# EAGLE design US_balise (EAGLE 5.11)
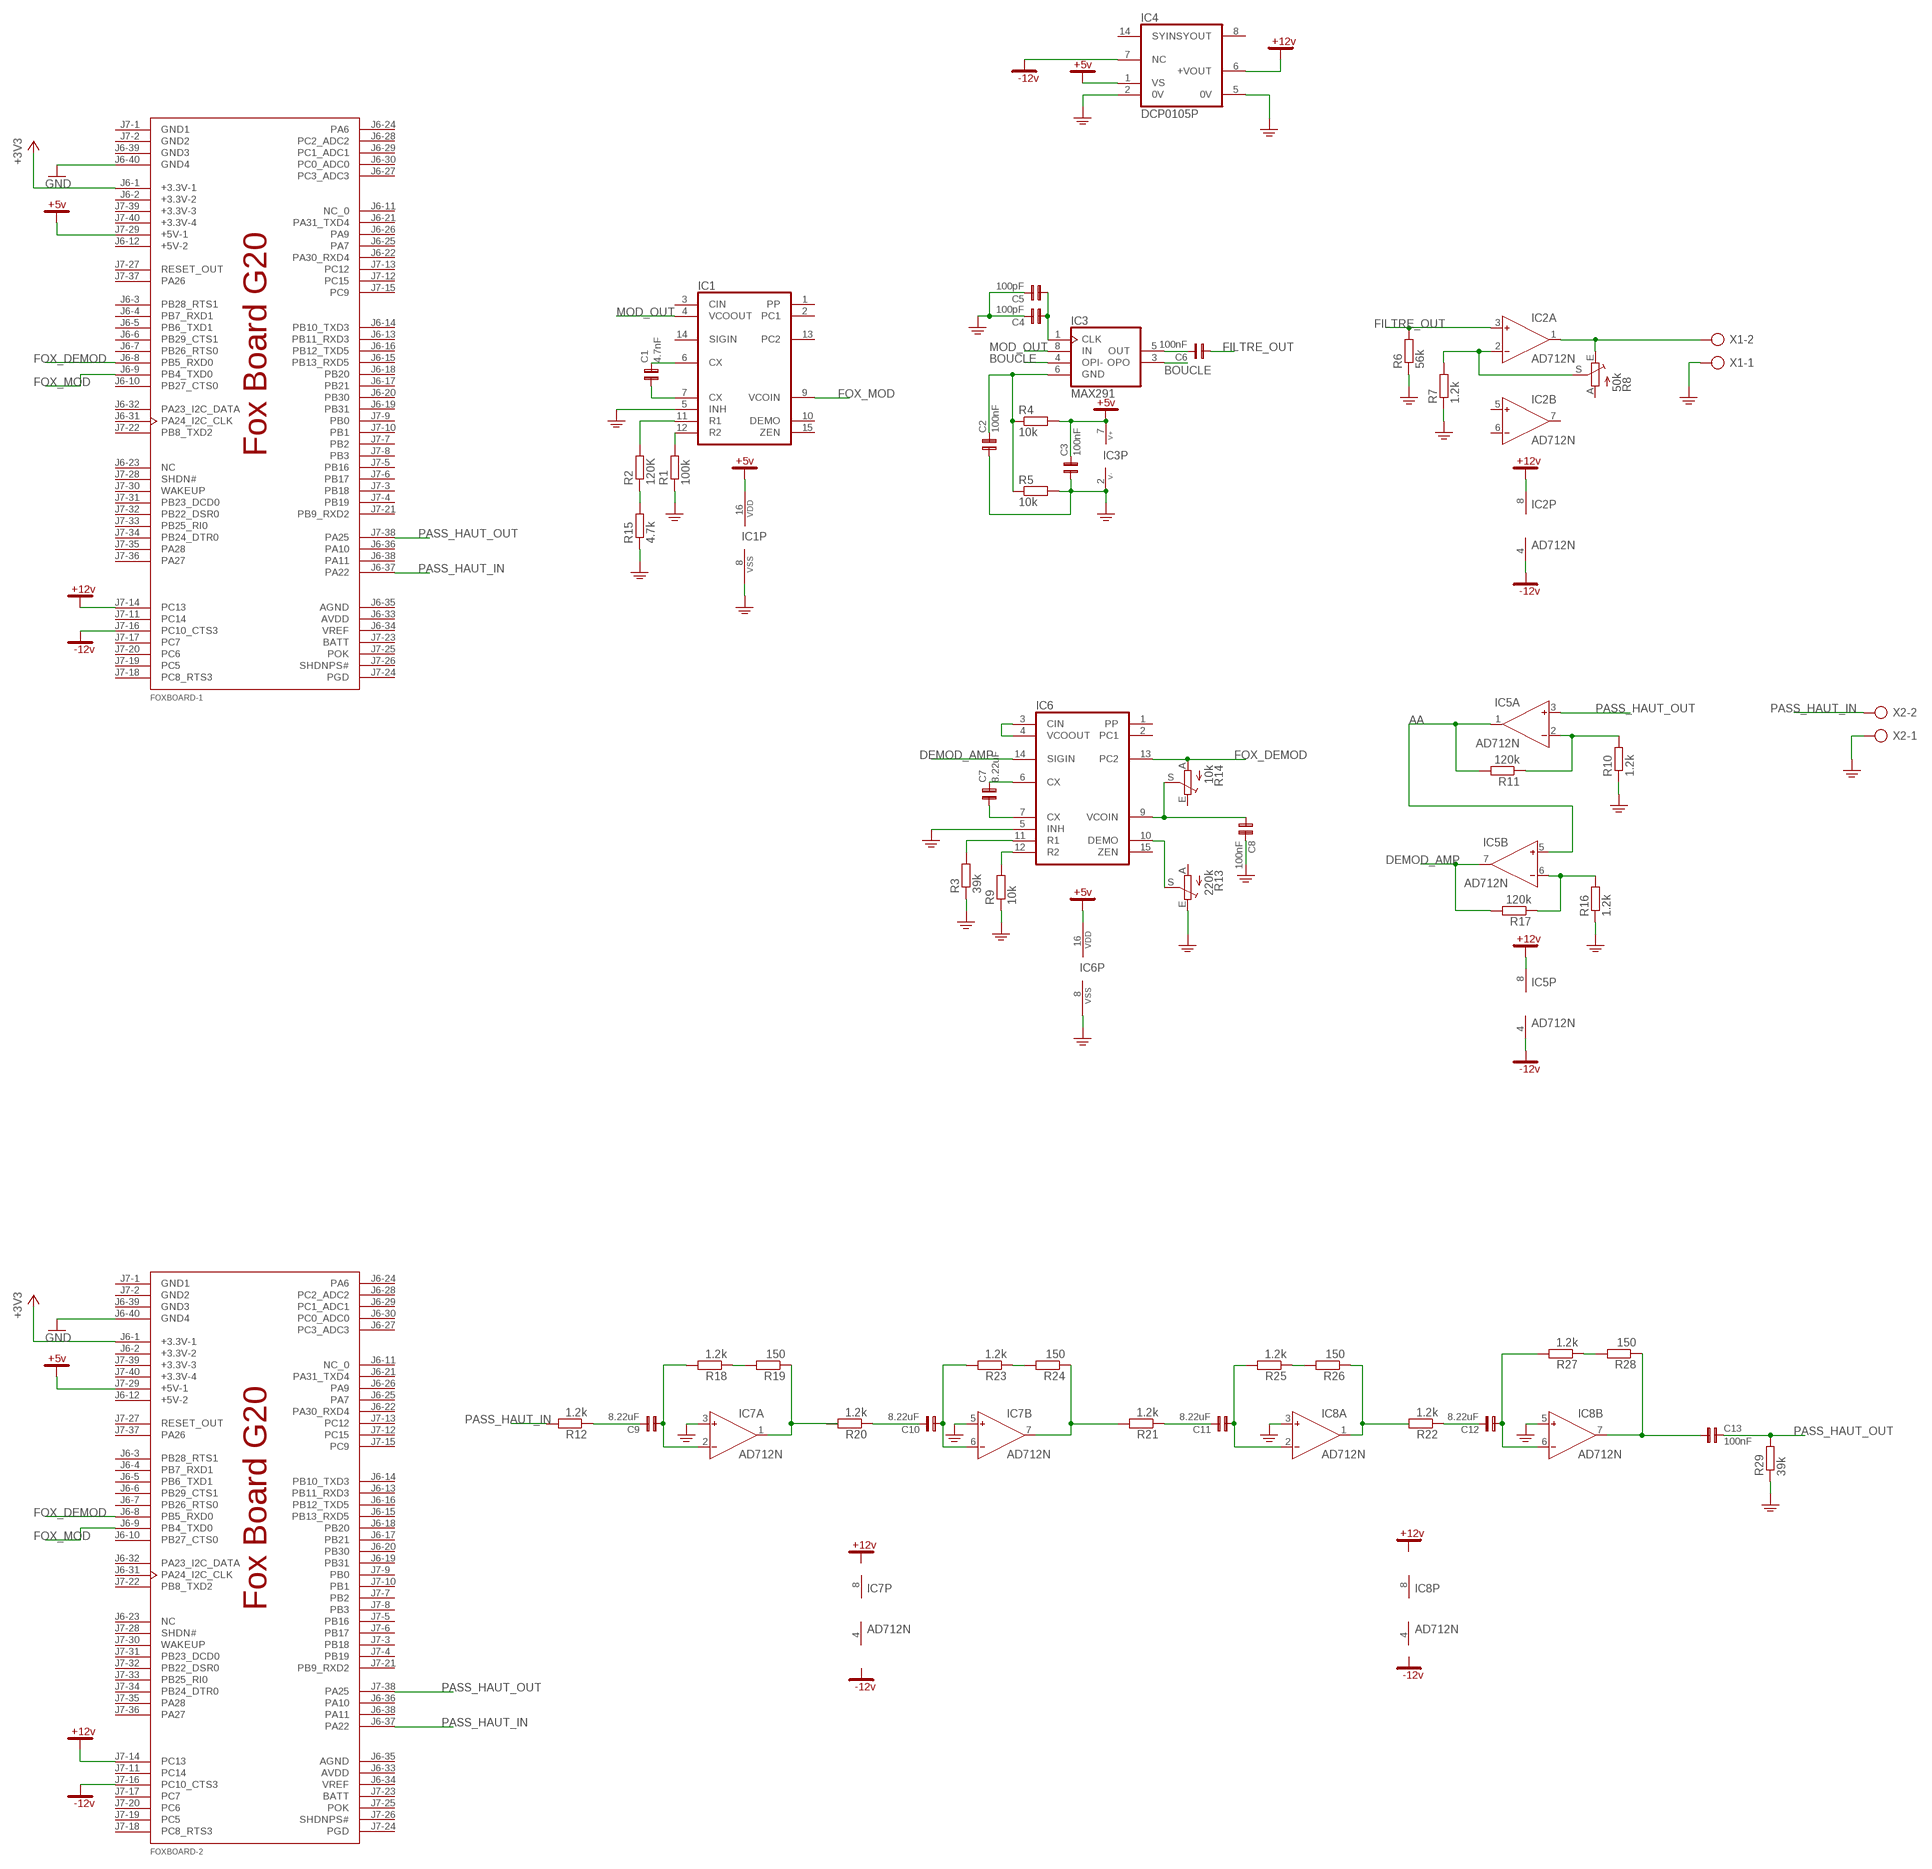
[diagram p0: schematic, sheet 1]

## Parts
C1  4.7nF  C5B2,5  [C5B2,5]
C2  100nF  C5B2,5E  [C5B2,5A]
C3  100nF  C5B2,5E  [C5B2,5A]
C4  100pF  C5B2,5  [C5B2,5]
C5  100pF  C5B2,5  [C5B2,5]
C6  100nF  C5B2,5E  [C5B2,5A]
C7  8.22uF  C5B2,5  [C5B2,5]
C8  100nF  C5B2,5E  [C5B2,5A]
C9  8.22uF  C5B2,5  [C5B2,5]
C10  8.22uF  C5B2,5  [C5B2,5]
C11  8.22uF  C5B2,5  [C5B2,5]
C12  8.22uF  C5B2,5  [C5B2,5]
C13  100nF  C5B2,5E  [C5B2,5A]
FOXBOARD-1  FOX-BOARD  [FOX-BOARD]
FOXBOARD-2  FOX-BOARD  [FOX-BOARD]
IC1  4046  [DIL16]
IC2  AD712N  [DIL08]
IC3  MAX291  [DIL08]
IC4  DCP0105P  [DIL14/7]
IC5  AD712N  [DIL08]
IC6  4046  [DIL16]
IC7  AD712N  [DIL08]
IC8  AD712N  [DIL08]
R1  100k  R-EU_0309/12  [0309/12]
R2  120K  R-EU_0309/12  [0309/12]
R3  39k  R-EU_0309/12  [0309/12]
R4  10k  R-EU_0309/12  [0309/12]
R5  10k  R-EU_0309/12  [0309/12]
R6  56k  R-EU_0309/12  [0309/12]
R7  1.2k  R-EU_0309/12  [0309/12]
R8  50k  TRIM_EU-B90P  [SP19L]
R9  10k  R-EU_0309/12  [0309/12]
R10  1.2k  R-EU_0309/12  [0309/12]
R11  120k  R-EU_0309/12  [0309/12]
R12  1.2k  R-EU_0309/12  [0309/12]
R13  220k  TRIM_EU-B90P  [SP19L]
R14  10k  TRIM_EU-S63P  [S63P]
R15  4.7k  R-EU_0309/12  [0309/12]
R16  1.2k  R-EU_0309/12  [0309/12]
R17  120k  R-EU_0309/12  [0309/12]
R18  1.2k  R-EU_0309/12  [0309/12]
R19  150  R-EU_0309/12  [0309/12]
R20  1.2k  R-EU_0309/12  [0309/12]
R21  1.2k  R-EU_0309/12  [0309/12]
R22  1.2k  R-EU_0309/12  [0309/12]
R23  1.2k  R-EU_0309/12  [0309/12]
R24  150  R-EU_0309/12  [0309/12]
R25  1.2k  R-EU_0309/12  [0309/12]
R26  150  R-EU_0309/12  [0309/12]
R27  1.2k  R-EU_0309/12  [0309/12]
R28  150  R-EU_0309/12  [0309/12]
R29  39k  R-EU_0309/12  [0309/12]
X1  AK300/2  [AK300/2]
X2  AK300/2  [AK300/2]

## Nets
+3V3: FOXBOARD-1.J6-1(+3.3V-1) FOXBOARD-2.J6-1(+3.3V-1)
+5V: C3.2 FOXBOARD-1.J7-29(+5V-1) FOXBOARD-2.J7-29(+5V-1) IC1.16(VDD) IC3.7(V+) IC4.1(VS) IC6.16(VDD) R4.2
+12V: FOXBOARD-1.J7-14(PC13) FOXBOARD-2.J7-14(PC13) IC2.8(P:V+) IC4.6(+VOUT) IC5.8(P:V+)
-12V: FOXBOARD-1.J7-16(PC10_CTS3) FOXBOARD-2.J7-16(PC10_CTS3) IC2.4(P:V-) IC4.7(NC) IC5.4(P:V-)
AA: IC5.1(A:OUT) IC5.5(B:IN+) R11.2
BOUCLE: IC3.3(OPO) IC3.4(OPI-)
DEMOD_AMP: IC5.7(B:OUT) IC6.14(SIGIN) R17.2
FILTRE_OUT: C6.1 IC2.3(A:IN+) R6.2
FOX_DEMOD: FOXBOARD-1.J6-8(PB5_RXD0) FOXBOARD-2.J6-8(PB5_RXD0) IC6.13(PC2) R14.A
FOX_MOD: FOXBOARD-1.J6-9(PB4_TXD0) FOXBOARD-2.J6-9(PB4_TXD0) IC1.9(VCOIN)
GND: C2.1 C3.1 C4.2 C5.2 C8.2 FOXBOARD-1.J6-40(GND4) FOXBOARD-2.J6-40(GND4) IC1.5(INH) IC1.8(VSS) IC3.2(V-) IC4.2(0V) IC4.5(0V) IC6.5(INH) IC6.8(VSS) IC7.3(A:IN+) IC7.5(B:IN+) IC8.3(A:IN+) IC8.5(B:IN+) R1.1 R3.1 R5.2 R6.1 R7.1 R9.1 R10.1 R13.E R15.1 R16.1 R29.1 X1.1 X2.1
MOD_OUT: IC1.4(VCOOUT) IC3.8(IN)
N$1: C1.2 IC1.6(CX)
N$2: C1.1 IC1.7(CX)
N$3: IC1.12(R2) R1.2
N$4: IC1.11(R1) R2.2
N$5: IC6.12(R2) R9.2
N$6: C6.2 IC3.5(OUT)
N$7: C2.2 IC3.6(GND) R4.1 R5.1
N$8: R2.1 R15.2
N$9: C4.1 C5.1 IC3.1(CLK)
N$10: IC2.2(A:IN-) R7.2 R8.S
N$11: IC2.1(A:OUT) R8.E X1.2
N$12: IC5.6(B:IN-) R16.2 R17.1
N$13: IC6.3(CIN) IC6.4(VCOOUT)
N$14: IC5.2(A:IN-) R10.2 R11.1
N$15: C7.2 IC6.6(CX)
N$16: C7.1 IC6.7(CX)
N$17: IC6.11(R1) R3.2
N$19: IC6.10(DEMO) R13.S
N$21: C8.1 IC6.9(VCOIN) R14.S
N$23: C9.2 R12.1
N$25: C9.1 IC7.2(A:IN-) R18.2
N$27: R18.1 R19.2
N$28: IC7.1(A:OUT) R19.1
N$29: C10.2 R20.1
N$30: C10.1 IC7.6(B:IN-) R23.2
N$31: R23.1 R24.2
N$33: IC7.7(B:OUT) R21.2 R24.1
N$34: C11.2 R21.1
N$35: C11.1 IC8.2(A:IN-) R25.2
N$36: R25.1 R26.2
N$37: IC8.1(A:OUT) R26.1
N$38: C12.2 R22.1
N$39: C12.1 IC8.6(B:IN-) R27.2
N$40: R27.1 R28.2
N$41: C13.1 IC8.7(B:OUT) R28.1
PASS_HAUT_IN: FOXBOARD-1.J6-37(PA22) FOXBOARD-2.J6-37(PA22) R12.2 X2.2
PASS_HAUT_OUT: C13.2 FOXBOARD-1.J7-38(PA25) FOXBOARD-2.J7-38(PA25) IC5.3(A:IN+) R29.2
Unconnected: FOXBOARD-1.J6-3(PB28_RTS1) FOXBOARD-1.J6-4(PB7_RXD1) FOXBOARD-1.J6-5(PB6_TXD1) FOXBOARD-1.J6-6(PB29_CTS1) FOXBOARD-1.J6-7(PB26_RTS0) FOXBOARD-1.J6-10(PB27_CTS0) FOXBOARD-1.J6-11(NC_0) FOXBOARD-1.J6-13(PB11_RXD3) FOXBOARD-1.J6-14(PB10_TXD3) FOXBOARD-1.J6-15(PB13_RXD5) FOXBOARD-1.J6-16(PB12_TXD5) FOXBOARD-1.J6-17(PB21) FOXBOARD-1.J6-18(PB20) FOXBOARD-1.J6-19(PB31) FOXBOARD-1.J6-20(PB30) FOXBOARD-1.J6-21(PA31_TXD4) FOXBOARD-1.J6-22(PA30_RXD4) FOXBOARD-1.J6-23(NC) FOXBOARD-1.J6-24(PA6) FOXBOARD-1.J6-25(PA7) FOXBOARD-1.J6-26(PA9) FOXBOARD-1.J6-27(PC3_ADC3) FOXBOARD-1.J6-28(PC2_ADC2) FOXBOARD-1.J6-29(PC1_ADC1) FOXBOARD-1.J6-30(PC0_ADC0) FOXBOARD-1.J6-31(PA24_I2C_CLK) FOXBOARD-1.J6-32(PA23_I2C_DATA) FOXBOARD-1.J6-33(AVDD) FOXBOARD-1.J6-34(VREF) FOXBOARD-1.J6-35(AGND) FOXBOARD-1.J6-36(PA10) FOXBOARD-1.J6-38(PA11) FOXBOARD-1.J7-3(PB18) FOXBOARD-1.J7-4(PB19) FOXBOARD-1.J7-5(PB16) FOXBOARD-1.J7-6(PB17) FOXBOARD-1.J7-7(PB2) FOXBOARD-1.J7-8(PB3) FOXBOARD-1.J7-9(PB0) FOXBOARD-1.J7-10(PB1) FOXBOARD-1.J7-11(PC14) FOXBOARD-1.J7-12(PC15) FOXBOARD-1.J7-13(PC12) FOXBOARD-1.J7-15(PC9) FOXBOARD-1.J7-17(PC7) FOXBOARD-1.J7-18(PC8_RTS3) FOXBOARD-1.J7-19(PC5) FOXBOARD-1.J7-20(PC6) FOXBOARD-1.J7-21(PB9_RXD2) FOXBOARD-1.J7-22(PB8_TXD2) FOXBOARD-1.J7-23(BATT) FOXBOARD-1.J7-24(PGD) FOXBOARD-1.J7-25(POK) FOXBOARD-1.J7-26(SHDNPS#) FOXBOARD-1.J7-27(RESET_OUT) FOXBOARD-1.J7-28(SHDN#) FOXBOARD-1.J7-30(WAKEUP) FOXBOARD-1.J7-31(PB23_DCD0) FOXBOARD-1.J7-32(PB22_DSR0) FOXBOARD-1.J7-33(PB25_RI0) FOXBOARD-1.J7-34(PB24_DTR0) FOXBOARD-1.J7-35(PA28) FOXBOARD-1.J7-36(PA27) FOXBOARD-1.J7-37(PA26) FOXBOARD-2.J6-3(PB28_RTS1) FOXBOARD-2.J6-4(PB7_RXD1) FOXBOARD-2.J6-5(PB6_TXD1) FOXBOARD-2.J6-6(PB29_CTS1) FOXBOARD-2.J6-7(PB26_RTS0) FOXBOARD-2.J6-10(PB27_CTS0) FOXBOARD-2.J6-11(NC_0) FOXBOARD-2.J6-13(PB11_RXD3) FOXBOARD-2.J6-14(PB10_TXD3) FOXBOARD-2.J6-15(PB13_RXD5) FOXBOARD-2.J6-16(PB12_TXD5) FOXBOARD-2.J6-17(PB21) FOXBOARD-2.J6-18(PB20) FOXBOARD-2.J6-19(PB31) FOXBOARD-2.J6-20(PB30) FOXBOARD-2.J6-21(PA31_TXD4) FOXBOARD-2.J6-22(PA30_RXD4) FOXBOARD-2.J6-23(NC) FOXBOARD-2.J6-24(PA6) FOXBOARD-2.J6-25(PA7) FOXBOARD-2.J6-26(PA9) FOXBOARD-2.J6-27(PC3_ADC3) FOXBOARD-2.J6-28(PC2_ADC2) FOXBOARD-2.J6-29(PC1_ADC1) FOXBOARD-2.J6-30(PC0_ADC0) FOXBOARD-2.J6-31(PA24_I2C_CLK) FOXBOARD-2.J6-32(PA23_I2C_DATA) FOXBOARD-2.J6-33(AVDD) FOXBOARD-2.J6-34(VREF) FOXBOARD-2.J6-35(AGND) FOXBOARD-2.J6-36(PA10) FOXBOARD-2.J6-38(PA11) FOXBOARD-2.J7-3(PB18) FOXBOARD-2.J7-4(PB19) FOXBOARD-2.J7-5(PB16) FOXBOARD-2.J7-6(PB17) FOXBOARD-2.J7-7(PB2) FOXBOARD-2.J7-8(PB3) FOXBOARD-2.J7-9(PB0) FOXBOARD-2.J7-10(PB1) FOXBOARD-2.J7-11(PC14) FOXBOARD-2.J7-12(PC15) FOXBOARD-2.J7-13(PC12) FOXBOARD-2.J7-15(PC9) FOXBOARD-2.J7-17(PC7) FOXBOARD-2.J7-18(PC8_RTS3) FOXBOARD-2.J7-19(PC5) FOXBOARD-2.J7-20(PC6) FOXBOARD-2.J7-21(PB9_RXD2) FOXBOARD-2.J7-22(PB8_TXD2) FOXBOARD-2.J7-23(BATT) FOXBOARD-2.J7-24(PGD) FOXBOARD-2.J7-25(POK) FOXBOARD-2.J7-26(SHDNPS#) FOXBOARD-2.J7-27(RESET_OUT) FOXBOARD-2.J7-28(SHDN#) FOXBOARD-2.J7-30(WAKEUP) FOXBOARD-2.J7-31(PB23_DCD0) FOXBOARD-2.J7-32(PB22_DSR0) FOXBOARD-2.J7-33(PB25_RI0) FOXBOARD-2.J7-34(PB24_DTR0) FOXBOARD-2.J7-35(PA28) FOXBOARD-2.J7-36(PA27) FOXBOARD-2.J7-37(PA26) IC1.1(PP) IC1.2(PC1) IC1.3(CIN) IC1.10(DEMO) IC1.13(PC2) IC1.14(SIGIN) IC1.15(ZEN) IC2.5(B:IN+) IC2.6(B:IN-) IC2.7(B:OUT) IC4.8(SYOUT) IC4.14(SYIN) IC6.1(PP) IC6.2(PC1) IC6.15(ZEN) R8.A R13.A R14.E R20.2 R22.2

## Power pins joined to a net without a drawn wire
+3.3V-2: FOXBOARD-1.J6-2(+3.3V-2) FOXBOARD-2.J6-2(+3.3V-2)
+3.3V-3: FOXBOARD-1.J7-39(+3.3V-3) FOXBOARD-2.J7-39(+3.3V-3)
+3.3V-4: FOXBOARD-1.J7-40(+3.3V-4) FOXBOARD-2.J7-40(+3.3V-4)
+5V-2: FOXBOARD-1.J6-12(+5V-2) FOXBOARD-2.J6-12(+5V-2)
GND1: FOXBOARD-1.J7-1(GND1) FOXBOARD-2.J7-1(GND1)
GND2: FOXBOARD-1.J7-2(GND2) FOXBOARD-2.J7-2(GND2)
GND3: FOXBOARD-1.J6-39(GND3) FOXBOARD-2.J6-39(GND3)
V+: IC7.8(P:V+) IC8.8(P:V+)
V-: IC7.4(P:V-) IC8.4(P:V-)

## Library data of the parts
C1 C4 C5 C7 C9-C12 = CAP:C5B2,5
C2 C3 C6 C8 C13 = CAP:C5B2,5E
FOXBOARD-1 FOXBOARD-2 = Julien:FOX-BOARD
IC1 IC6 = 40XX:4046
IC2 IC5 IC7 IC8 = analog-devices:AD712: Dual Precision, Low Cost, High Speed BiFET Op Amp Source: http://www.analog.com/static/imported-files/data_sheets/AD712.pdf; MF: ALTERA CORPORATION; MPN: AD712JNZ; OC_FARNELL: 9604898; OC_NEWARK: 59K4554
IC3 = maxim:MAX291: DIGITAL FILTER; MPN: MAX291CPA+; OC_FARNELL: unknown; OC_NEWARK: 67K4526
IC4 = burr-brown:DCP0105: DC/DC Converters Miniature 5V Input, 1W Isolated Unregulated; MPN: DCP010512BP-U; OC_FARNELL: 1461015; OC_NEWARK: 61M5777
R1-R7 R9-R12 R15-R29 = rcl:R-EU_: RESISTOR, European symbol
R8 R13 R14 = pot:TRIM_EU-: POTENTIOMETER
X1 X2 = con-ptr500:AK300/2: CONNECTOR; OC_FARNELL: unknown; OC_NEWARK: unknown

## Board
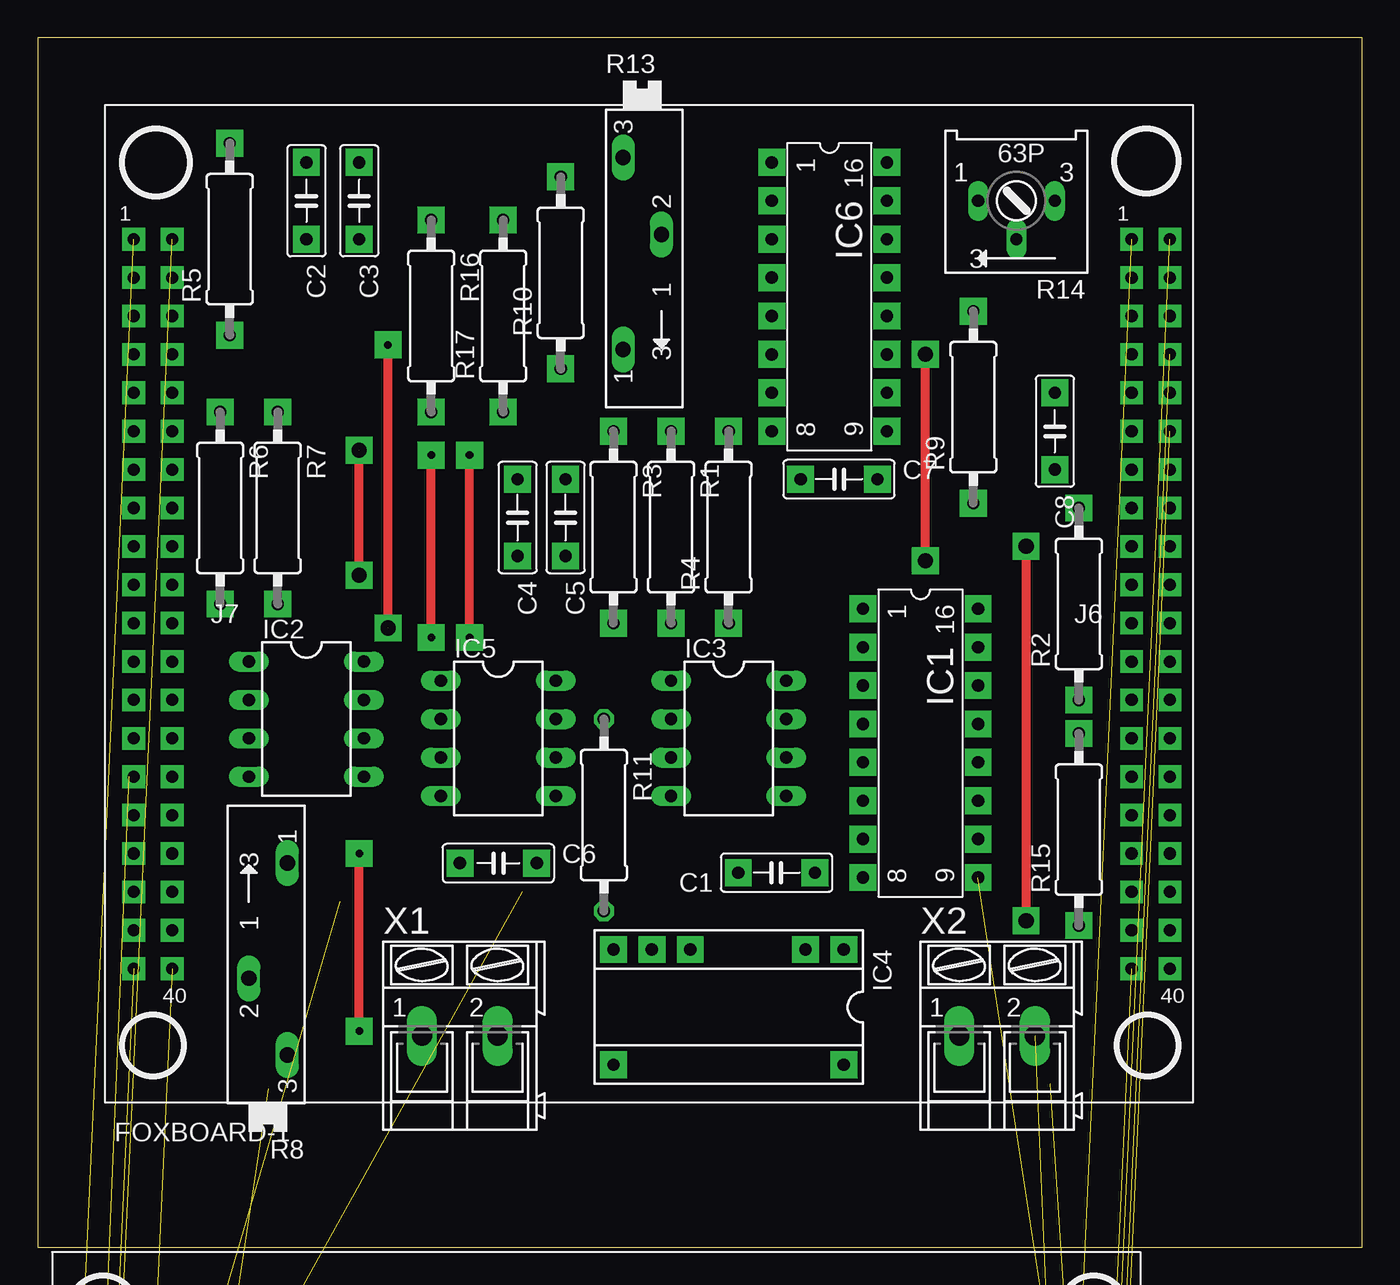
[diagram p1: board, top side]
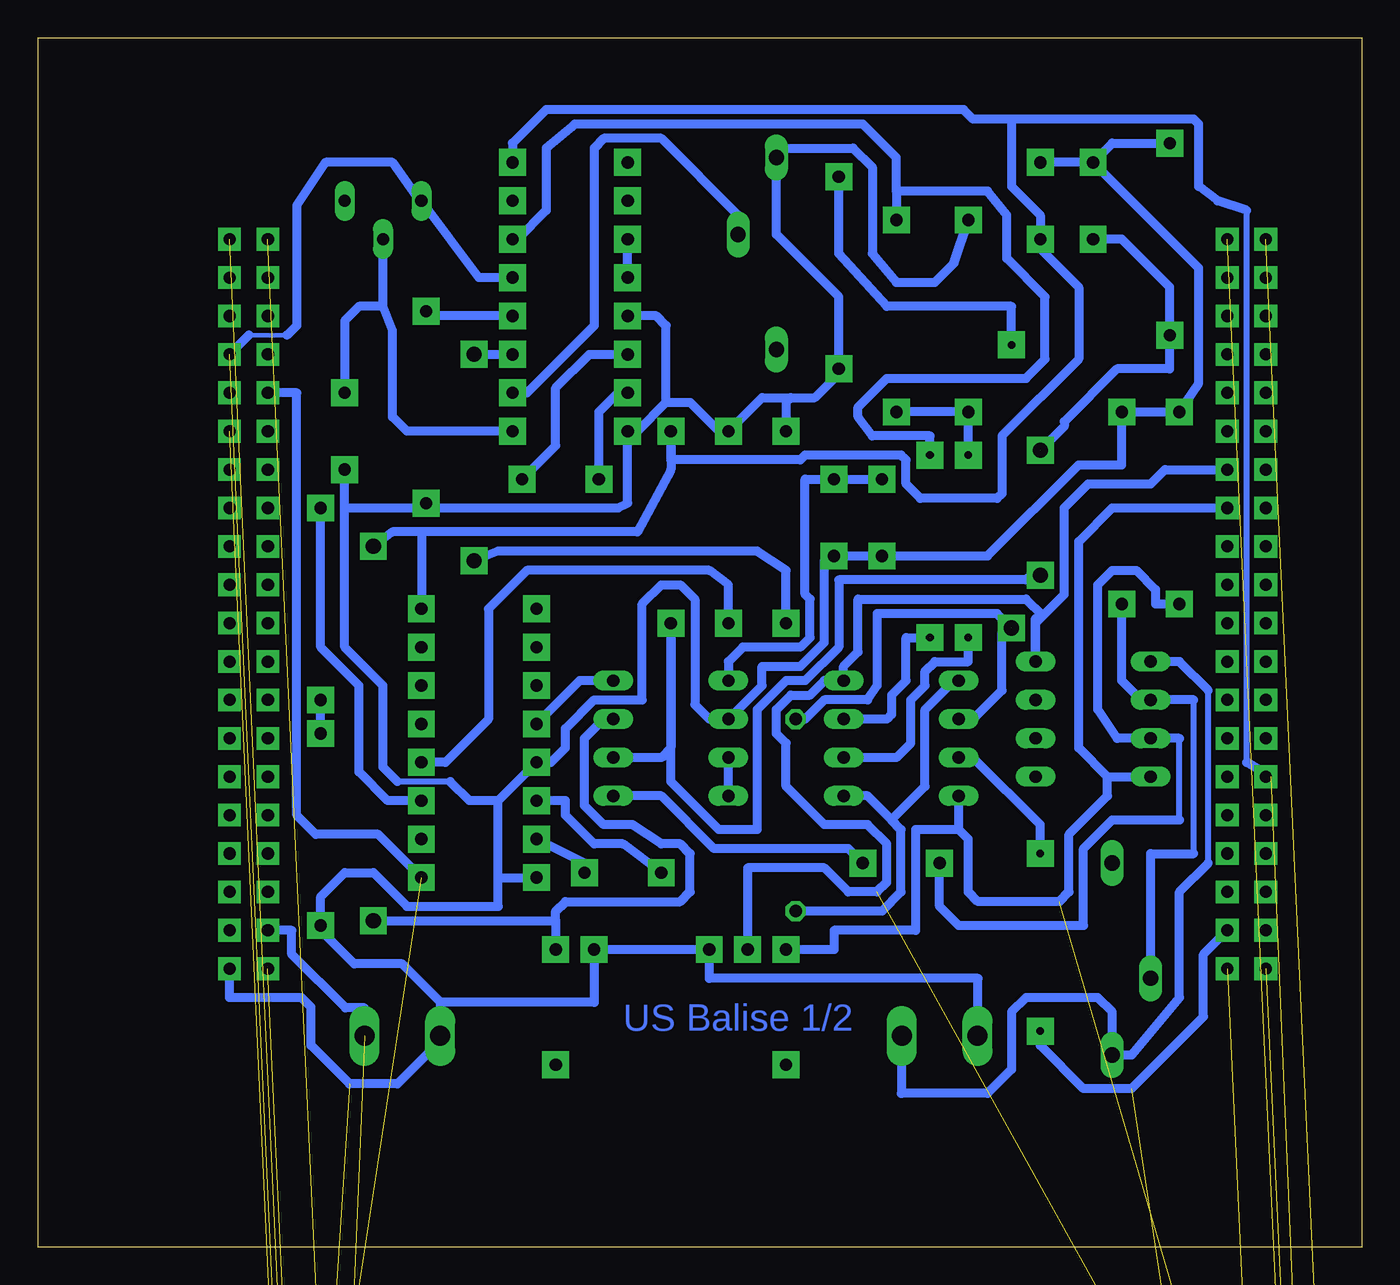
[diagram p2: board, bottom side, seen from below]

Size 87.62 x 80 mm. Coordinates in mm from the lower left corner, seen from the top.
Outline: 0,0 87.62,0 87.62,80 0,80 0,0
Copper layers (1*16): Top 0.035mm / dielectric 1.5mm / Bottom 0.035mm
Design rules "default": minimum track width 10mil, minimum drill 24mil, track to track 8mil, track to pad 8mil, pad to pad 8mil, via to via 8mil, smd to smd 8mil, copper to edge 40mil, drill to drill 8mil, minimum pad ring 10mil, minimum via ring 8mil, stop-mask expansion 4mil, vias tented up to drill 0mil, thermal gap 10mil

### Footprints (pad centres in the part's own frame; a part is rotated, then mirrored left to right if it is on the bottom)
C5B2,5 = drill 0.813 pad 1.778 square: 1 -2.54,0; 2 2.54,0
C5B2,5A = drill 0.813 pad 1.778 square: 1 -2.54,0; 2 2.54,0
FOX-BOARD = drill 0.8 pad 1.5 square: J6-1 31.75,22.86; J6-2 34.29,22.86; J6-3 31.75,20.32; J6-4 34.29,20.32; J6-5 31.75,17.78; J6-6 34.29,17.78; J6-7 31.75,15.24; J6-8 34.29,15.24; J6-9 31.75,12.7; J6-10 34.29,12.7; J6-11 31.75,10.16; J6-12 34.29,10.16; J6-13 31.75,7.62; J6-14 34.29,7.62; J6-15 31.75,5.08; J6-16 34.29,5.08; J6-17 31.75,2.54; J6-18 34.29,2.54; J6-19 31.75,0; J6-20 34.29,0; J6-21 31.75,-2.54; J6-22 34.29,-2.54; J6-23 31.75,-5.08; J6-24 34.29,-5.08; J6-25 31.75,-7.62; J6-26 34.29,-7.62; J6-27 31.75,-10.16; J6-28 34.29,-10.16; J6-29 31.75,-12.7; J6-30 34.29,-12.7; J6-31 31.75,-15.24; J6-32 34.29,-15.24; J6-33 31.75,-17.78; J6-34 34.29,-17.78; J6-35 31.75,-20.32; J6-36 34.29,-20.32; J6-37 31.75,-22.86; J6-38 34.29,-22.86; J6-39 31.75,-25.4; J6-40 34.29,-25.4; J7-1 -34.29,22.86; J7-2 -31.75,22.86; J7-3 -34.29,20.32; J7-4 -31.75,20.32; J7-5 -34.29,17.78; J7-6 -31.75,17.78; J7-7 -34.29,15.24; J7-8 -31.75,15.24; J7-9 -34.29,12.7; J7-10 -31.75,12.7; J7-11 -34.29,10.16; J7-12 -31.75,10.16; J7-13 -34.29,7.62; J7-14 -31.75,7.62; J7-15 -34.29,5.08; J7-16 -31.75,5.08; J7-17 -34.29,2.54; J7-18 -31.75,2.54; J7-19 -34.29,0; J7-20 -31.75,0; J7-21 -34.29,-2.54; J7-22 -31.75,-2.54; J7-23 -34.29,-5.08; J7-24 -31.75,-5.08; J7-25 -34.29,-7.62; J7-26 -31.75,-7.62; J7-27 -34.29,-10.16; J7-28 -31.75,-10.16; J7-29 -34.29,-12.7; J7-30 -31.75,-12.7; J7-31 -34.29,-15.24; J7-32 -31.75,-15.24; J7-33 -34.29,-17.78; J7-34 -31.75,-17.78; J7-35 -34.29,-20.32; J7-36 -31.75,-20.32; J7-37 -34.29,-22.86; J7-38 -31.75,-22.86; J7-39 -34.29,-25.4; J7-40 -31.75,-25.4
DIL16 = drill 0.813 pad 1.778 square: 1 -8.89,-3.81; 2 -6.35,-3.81; 3 -3.81,-3.81; 4 -1.27,-3.81; 5 1.27,-3.81; 6 3.81,-3.81; 7 6.35,-3.81; 8 8.89,-3.81; 9 8.89,3.81; 10 6.35,3.81; 11 3.81,3.81; 12 1.27,3.81; 13 -1.27,3.81; 14 -3.81,3.81; 15 -6.35,3.81; 16 -8.89,3.81
DIL08 = drill 0.813 long: 1 -3.81,-3.81; 2 -1.27,-3.81; 3 1.27,-3.81; 4 3.81,-3.81; 5 3.81,3.81; 6 1.27,3.81; 7 -1.27,3.81; 8 -3.81,3.81
DIL14/7 = drill 0.813 pad 1.6 octagon: 1 -7.62,-3.81; 2 -5.08,-3.81; 5 2.54,-3.81; 6 5.08,-3.81; 7 7.62,-3.81; 8 7.62,3.81; 14 -7.62,3.81
0309/12 = drill 0.813 octagon: 1 -6.35,0; 2 6.35,0
SP19L = drill 1.016 long: A 5.715,-1.27; E -6.985,-1.27; S -1.905,1.27
S63P = drill 0.813 long: A 2.54,0; E -2.54,0; S 0,2.54
AK300/2 = drill 1.321 long: 1 -2.515,0; 2 2.489,0

### Placement (x,y rotation side)
C1  48.9,24.77 180 top
C2  17.78,69.22 270 top
C3  21.27,69.22 270 top
C4  31.75,48.26 270 top
C5  34.92,48.26 270 top
C6  30.48,25.4 0 top
C7  53.02,50.8 0 top
C8  67.31,53.98 270 top
C9  1.59,-119.38 0 top  (outside the outline)
C10  -0.32,-146.69 0 top  (outside the outline)
C11  -0.32,-157.16 0 top  (outside the outline)
C12  -0.32,-167.64 0 top  (outside the outline)
C13  -0.64,-207.65 0 top  (outside the outline)
FOXBOARD-1  40.64,43.81 0 top
FOXBOARD-2  37.15,-32.07 0 top  (outside the outline)
IC1  58.42,33.34 270 top
IC2  17.78,34.92 270 top
IC3  45.72,33.66 270 top
IC4  45.72,15.88 180 top
IC5  30.48,33.66 270 top
IC6  52.39,62.87 270 top
IC7  5.4,-98.11 0 top  (outside the outline)
IC8  5.08,-110.81 0 top  (outside the outline)
R1  41.91,47.62 270 top
R2  68.9,42.55 90 top
R3  38.1,47.62 270 top
R4  45.72,47.62 90 top
R5  12.7,66.67 90 top
R6  12.06,48.9 270 top
R7  15.88,48.9 270 top
R8  15.24,19.68 90 top
R9  61.91,55.56 90 top
R10  34.61,64.45 90 top
R11  37.47,28.57 270 top
R12  5.08,-125.73 0 top  (outside the outline)
R13  40.01,65.09 270 top
R14  64.77,69.22 180 top
R15  68.9,27.62 90 top
R16  26.04,61.59 270 top
R17  30.8,61.59 90 top
R18  4.45,-131.13 0 top  (outside the outline)
R19  3.81,-136.53 0 top  (outside the outline)
R20  3.81,-142.56 0 top  (outside the outline)
R21  3.81,-153.03 0 top  (outside the outline)
R22  3.81,-163.51 0 top  (outside the outline)
R23  3.81,-173.99 0 top  (outside the outline)
R24  3.81,-180.02 0 top  (outside the outline)
R25  3.81,-186.06 0 top  (outside the outline)
R26  3.81,-192.09 0 top  (outside the outline)
R27  3.81,-198.12 0 top  (outside the outline)
R28  3.81,-204.15 0 top  (outside the outline)
R29  2.86,-214 0 top  (outside the outline)
X1  27.94,13.97 0 top
X2  63.5,13.97 0 top

### Tracks (layer width: path | path; a pad name or v marks a point on that pad's centre or on a via)
+3.3V-2  (1 unrouted)
+3.3V-3  (1 unrouted)
+3.3V-4  (1 unrouted)
+3V3  (1 unrouted)
+5V  (via drill 1 pad 0.13)  (1 unrouted)
  Top 0.61: v65.41,46.35 v65.41,21.59
  Bottom 0.406: 7.62,32.07 7.62,68.58
  Bottom 0.61: 53.34,21.59 53.34,22.23 52.7,22.86 45.09,22.86 44.45,23.5 44.45,26.04 45.09,26.67 46.35,26.67 48.26,27.94 50.16,27.94 51.44,29.21 51.44,33.66 50.16,34.92 IC3.7 | 53.34,21.59 IC4.1 | 62.23,47.31 IC1.16 | 62.23,47.31 47.94,47.31 45.72,51.44 R4.2 45.72,52.07 37.15,52.07 36.83,52.39 30.48,52.39 30.16,52.07 30.16,50.48 29.21,49.53 24.13,49.53 23.81,49.85 23.81,53.66 18.73,58.74 18.73,63.5 21.27,66.04 C3.2 21.27,68.26 23.18,70.17 23.18,74.61 | FOXBOARD-1.J7-29 6.03,31.11 7.62,32.07 | 7.62,68.58 9.53,69.22 10.79,70.17 10.79,74.3 11.11,74.61 23.18,74.61 | 62.23,47.31 64.14,47.31 v65.41,46.35 | v65.41,21.59 53.34,21.59 | IC6.16 56.2,73.03 53.98,75.25 26.35,75.25 25.72,74.61 23.18,74.61
+5V-2  (1 unrouted)
+12V  (1 unrouted)
  Bottom 0.61: IC4.6 40.64,25.08 35.56,25.08 33.97,23.5 32.07,23.5 31.43,24.13 31.43,26.67 32.7,27.94 35.56,27.94 38.1,30.48 38.1,33.34 38.73,33.97 38.73,35.56 37.78,36.51 36.51,36.51 35.56,37.47 IC5.8 34.29,38.42 33.34,39.37 33.34,42.86 22.23,42.86 21.11,41.75 | 21.11,41.75 19.68,43.18 19.68,48.9 18.1,50.48 13.97,50.48 13.02,51.44 FOXBOARD-1.J7-14 | 21.11,41.75 21.59,41.27 IC2.8 21.59,41.59
-12V  (1 unrouted)
  Bottom 0.61: 16.83,31.11 IC2.4 | 26.67,27.62 IC5.4 | IC4.7 34.92,19.68 34.92,20.95 29.53,20.95 29.53,27.62 26.67,27.62 | 16.83,31.11 16.83,29.84 19.37,27.3 19.37,23.5 20,22.86 25.4,22.86 26.04,23.5 26.04,26.99 26.67,27.62 | FOXBOARD-1.J7-16 16.51,48.9 18.73,46.67 18.73,33.02 16.83,31.11
AA
  Bottom 0.61: IC5.5 32.7,29.84 31.11,28.26 | R11.2 31.75,22.23 30.48,23.5 30.48,27.62 31.11,28.26 | IC5.1 26.99,37.47 28.89,35.56 28.89,30.48 31.11,28.26
BOUCLE
  Bottom 0.61: IC3.4 IC3.3
DEMOD_AMP  (via drill 0.5 pad 1.78)  (1 unrouted)
  Top 0.61: 28.57,40.32 v28.57,52.39
  Bottom 0.61: IC6.14 55.88,66.67 53.98,68.58 53.98,72.71 52.07,74.3 33.02,74.3 30.8,72.07 30.8,69.85 | 30.8,69.85 R17.2 | 30.8,69.85 24.77,69.85 23.5,68.26 23.5,65.41 20.95,62.87 20.95,58.74 22.23,57.47 31.43,57.47 33.34,55.56 33.34,54.93 32.38,53.66 28.57,53.66 v28.57,52.39 | IC5.7 31.43,34.92 31.11,35.24 31.11,36.51 30.16,37.47 30.16,40.32 28.57,40.32
FILTRE_OUT
  Bottom 0.406: 12.06,28.26 12.06,33.66
  Bottom 0.61: 12.06,28.26 16.51,28.26 18.41,26.35 18.41,21.27 26.67,21.27 27.94,22.54 C6.1 | 12.06,33.66 IC2.3 16.19,33.66 17.46,35.56 17.46,43.81 16.51,44.77 14.92,44.77 13.65,43.5 13.65,42.55 R6.2
FOX_DEMOD  (1 unrouted)
  Bottom 0.305: 71.12,60.33 73.66,60.33
  Bottom 0.61: 71.12,60.33 70.48,60.96 70.48,68.9 68.58,71.75 64.14,71.75 62.55,69.53 R14.A 58.42,64.14 IC6.13 | 73.66,60.33 FOXBOARD-1.J6-8
FOX_MOD  (1 unrouted)
  Bottom 0.61: FOXBOARD-1.J6-9 70.48,56.52 70.48,28.57 69.22,27.3 65.09,27.3 IC1.9
GND  (6 unrouted)
  Bottom 0.406: 60.33,30.8 63.82,30.8
  Bottom 0.61: FOXBOARD-1.J6-40 74.93,16.51 70.17,16.51 69.53,15.88 69.53,13.34 66.99,10.79 63.82,10.79 60.98,13.63 X2.1 60.98,16.19 | X1.1 25.4,13.97 25.4,17.78 43.18,17.78 IC4.5 IC4.2 50.8,16.19 60.98,16.19 | 57.15,24.45 IC1.8 | 57.15,24.45 57.15,22.54 63.18,22.54 65.41,24.77 67.31,24.77 68.9,23.18 R15.1 68.9,20.95 66.67,18.73 63.5,18.73 60.98,16.22 60.98,16.19 | C2.1 C3.1 | C2.1 10.79,64.77 10.79,57.15 R6.1 R7.1 15.88,51.75 18.73,51.75 24.77,45.72 C4.2 C5.2 35.56,45.4 35.56,40.01 37.15,38.42 39.69,38.42 39.69,37.15 IC3.2 43.18,34.92 44.13,35.88 44.13,42.86 45.09,43.81 46.35,43.81 47.62,42.55 47.62,36.2 50.8,36.2 52.7,34.29 52.7,33.02 53.66,32.07 IC1.5 57.15,29.53 | 67.31,48.9 61.91,48.9 | 61.91,48.9 49.21,48.9 48.58,49.21 IC6.8 47.94,53.98 46.04,55.88 | 67.31,48.9 C8.2 | 61.91,48.9 R9.1 | R5.2 16.51,73.03 C2.1 | 46.04,55.88 46.04,60.96 46.67,61.59 IC6.5 | 46.04,55.88 44.45,55.88 42.55,53.98 R1.1 39.69,56.2 37.78,56.2 | 37.78,56.2 36.2,56.2 34.61,57.78 R10.1 34.61,62.87 38.73,66.99 R13.E 38.1,72.71 33.66,72.71 32.38,71.44 32.38,65.72 30.8,63.82 28.26,63.82 26.99,65.09 R16.1 | 57.15,24.45 57.15,29.53 | 57.15,29.53 59.05,29.53 60.33,30.8 | 63.82,30.8 64.77,31.75 64.77,37.15 67.31,39.69 67.31,48.9 | R3.1 38.1,55.88 37.78,56.2
GND1  (1 unrouted)
GND2  (1 unrouted)
GND3  (1 unrouted)
MOD_OUT
  Bottom 0.61: IC3.8 51.75,37.47 IC1.4
N$1
  Bottom 0.61: IC1.6 52.7,29.53 52.7,28.57 50.8,26.67 48.9,26.67 C1.2
N$2
  Bottom 0.61: C1.1 51.44,25.4 IC1.7
N$3
  Bottom 0.61: R1.2 41.91,43.81 43.18,44.77 55.24,44.77 57.78,42.23 57.78,34.92 60.64,32.07 IC1.12
N$4
  Bottom 0.61: IC1.11 64.45,29.53 66.36,31.43 66.36,37.15 68.9,39.69 R2.2
N$5
  Bottom 0.61: IC6.12 61.59,61.59 R9.2
N$6
  Bottom 0.61: IC3.5 46.35,29.84 42.86,26.35 33.97,26.35 C6.2
N$7  (via drill 1 pad 0.13)  (1 unrouted)
  Top 0.61: v21.27,44.45 21.27,52.7
  Bottom 0.61: IC3.6 46.35,32.38 45.72,33.02 R4.1 45.72,30.8 42.55,27.62 40.01,27.62 40.01,35.56 38.1,37.47 36.83,37.47 34.61,39.69 34.61,44.13 22.23,44.13 21.91,44.45 v21.27,44.45 | C2.2 15.88,66.67 12.7,63.5 R5.1 12.7,58.1 16.19,58.1 19.68,54.61 19.68,54.29 21.27,52.7 21.27,52.39
N$8
  Bottom 0.61: R15.2 R2.1
N$9
  Bottom 0.61: C4.1 C5.1 36.83,50.8 36.83,43.18 36.51,42.86 36.51,40.32 37.15,39.69 40.96,39.69 41.91,38.73 IC3.1
N$10
  Bottom 0.406: 11.11,26.04 11.11,36.2
  Bottom 0.61: R8.S 13.97,26.04 11.11,26.04 | 11.11,36.2 IC2.2 14.61,36.2 15.88,37.47 R7.2
N$11
  Bottom 0.406: 10.16,25.4 10.16,36.83
  Bottom 0.61: 30.43,10.16 30.48,10.16 | 30.43,10.16 X1.2 | 10.16,25.4 12.06,23.5 12.06,16.51 15.24,12.7 R8.E 16.51,15.56 17.46,16.51 22.23,16.51 23.18,15.56 23.18,11.75 24.77,10.16 30.43,10.16 | 10.16,36.83 12.06,38.73 IC2.1
N$12  (via drill 0.5 pad 1.78)  (1 unrouted)
  Top 0.61: 26.04,40.32 v26.04,52.39
  Bottom 0.61: R17.1 R16.2 v26.04,52.39 | IC5.6 30.8,32.38 29.84,33.34 29.84,36.2 28.89,37.15 28.89,38.1 28.26,38.73 26.04,38.73 26.04,40.32
N$13
  Bottom 0.61: IC6.4 IC6.3
N$14  (via drill 0.5 pad 1.78)  (1 unrouted)
  Top 0.61: 23.18,40.96 v23.18,59.69
  Bottom 0.61: v23.18,59.69 23.18,62.23 31.43,62.23 34.61,65.72 R10.2 | IC5.2 25.72,34.92 23.81,36.83 23.81,40.64 23.34,41.12 | R11.1 36.83,34.92 35.56,36.2 32.7,36.2 32.07,37.15 32.07,41.91 24.13,41.91 23.34,41.12 | 23.34,41.12 23.18,40.96
N$15
  Bottom 0.61: IC6.6 51.12,59.05 53.34,56.83 53.34,53.02 C7.2 55.88,50.48
N$16
  Bottom 0.61: IC6.7 49.21,56.52 50.48,55.24 C7.1
N$17  (via drill 1 pad 0.13)
  Top 0.61: v58.74,45.4 v58.74,59.05
  Bottom 0.61: R3.2 38.1,44.77 40.01,46.04 57.15,46.04 v58.74,45.4 | v58.74,59.05 IC6.11
N$19
  Bottom 0.61: IC6.10 55.24,56.52 50.8,60.96 50.8,72.71 50.16,73.34 46.35,73.34 41.27,68.26 R13.S
N$20  (via drill 0.5 pad 1.78)
  other vias: 26.04,40.32
N$21
  Bottom 0.61: IC6.9 63.18,53.98 64.14,54.93 64.14,60.64 64.77,62.23 | 64.77,62.23 R14.S | 64.77,62.23 66.36,62.23 67.31,61.28 C8.1
N$22  (via drill 1 pad 0.13)
  other vias: 65.41,46.35
N$23  (1 unrouted)
N$24  (via drill 1 pad 0.13)
  other vias: 21.27,52.7
N$25  (2 unrouted)
N$26  (via drill 1 pad 0.13)
  other vias: 23.18,40.96
N$27  (1 unrouted)
N$28  (1 unrouted)
N$29  (1 unrouted)
N$30  (2 unrouted)
N$31  (1 unrouted)
N$32  (via drill 1 pad 0.13)
  other vias: 65.41,21.59
N$33  (2 unrouted)
N$34  (1 unrouted)
N$35  (2 unrouted)
N$36  (1 unrouted)
N$37  (1 unrouted)
N$38  (1 unrouted)
N$39  (2 unrouted)
N$40  (1 unrouted)
N$41  (2 unrouted)
N$42  (via drill 0.5 pad 1.78)
  other vias: 26.04,52.39
N$43  (via drill 0.5 pad 1.78)
  other vias: 26.04,67.94
N$44  (via drill 0.5 pad 1.78)
  other vias: 30.8,55.24
N$45  (via drill 0.5 pad 1.78)
  other vias: 26.04,55.24
N$46  (via drill 0.5 pad 1.78)
  other vias: 30.8,67.94
N$47  (via drill 0.5 pad 1.78)
  other vias: 65.41,46.35
N$48  (via drill 0.5 pad 1.78)
  other vias: 68.9,21.27
PASS_HAUT_IN  (2 unrouted)
  Bottom 0.61: X2.2 65.99,15.82 67.26,15.82 70.8,19.37 70.8,20.95 FOXBOARD-1.J6-37
PASS_HAUT_OUT  (via drill 0.5 pad 1.78)  (3 unrouted)
  Top 0.61: v21.27,14.29 v21.27,26.04
  Bottom 0.61: IC5.3 25.72,32.38 21.27,27.94 v21.27,26.04 | v21.27,14.29 21.27,13.34 18.41,10.48 15.24,10.48 10.48,15.24 10.48,19.37 FOXBOARD-1.J7-38
S$1  (via drill 1 pad 0.13)
  other vias: 58.74,45.4
S$2  (via drill 1 pad 0.13)
  other vias: 21.27,44.45
S$3  (via drill 0.5 pad 1.78)
  other vias: 68.9,36.2
S$5  (via drill 0.5 pad 1.78)
  other vias: 12.7,73.03
S$6  (via drill 0.5 pad 1.78)
  other vias: 45.72,41.27
S$7  (via drill 0.5 pad 1.78)
  other vias: 12.06,55.24
S$8  (via drill 0.5 pad 1.78)
  other vias: 15.88,55.24
S$9  (via drill 0.5 pad 1.78)
  other vias: 15.88,42.55
S$10  (via drill 0.5 pad 1.78)
  other vias: 12.06,42.55
S$11  (via drill 0.5 pad 1.78)
  other vias: 21.27,52.7
S$12  (via drill 0.5 pad 1.78)
  other vias: 21.27,44.45
S$14  (via drill 0.5 pad 1.78)
  other vias: 23.18,40.96
S$15  (via drill 0.5 pad 1.78)
  other vias: 28.57,40.32
S$16  (via drill 0.5 pad 1.78)
  other vias: 38.1,41.27
S$17  (via drill 0.5 pad 1.78)
  other vias: 41.91,41.27
S$19  (via drill 0.5 pad 1.78)
  other vias: 23.18,59.69
S$20  (via drill 0.5 pad 1.78)
  other vias: 34.61,70.8
S$21  (via drill 0.5 pad 1.78)
  other vias: 38.1,53.98
S$22  (via drill 0.5 pad 1.78)
  other vias: 28.57,52.39
S$23  (via drill 0.5 pad 1.78)
  other vias: 41.91,53.98
S$24  (via drill 0.5 pad 1.78)
  other vias: 45.72,53.98
S$25  (via drill 0.5 pad 1.78)
  other vias: 34.61,58.1
S$26  (via drill 0.5 pad 1.78)
  other vias: 61.91,61.91
S$27  (via drill 0.5 pad 1.78)
  other vias: 58.74,59.05
S$28  (via drill 0.5 pad 1.78)
  other vias: 61.91,49.21
S$29  (via drill 0.5 pad 1.78)
  other vias: 58.74,45.4
S$30  (via drill 0.5 pad 1.78)
  other vias: 68.9,33.97
S$31  (via drill 0.5 pad 1.78)
  other vias: 68.9,48.9
S$32  (via drill 0.5 pad 1.78)
  other vias: 65.41,21.59
S$33  (via drill 0.5 pad 1.78)
  other vias: 12.7,60.33
S$34  (via drill 0.5 pad 1.78)
  other vias: 50.8,19.68
S$35  (via drill 0.5 pad 1.78)
  other vias: 38.1,12.06
S$36  (via drill 0.5 pad 1.78)
  other vias: 21.27,26.04
S$37  (via drill 0.5 pad 1.78)
  other vias: 21.27,14.29
S$39  (via drill 0.5 pad 1.78)
  other vias: 53.34,12.06
S$40  (via drill 0.5 pad 1.78)
  other vias: 53.34,19.68
S$41  (via drill 0.5 pad 1.78)
  other vias: 40.64,19.68
S$42  (via drill 0.5 pad 1.78)
  other vias: 38.1,19.68
S$43  (via drill 0.5 pad 1.78)
  other vias: 43.18,19.68
V+  (1 unrouted)
V-  (1 unrouted)

### Text on the board
Bottom: US Balise 1/2